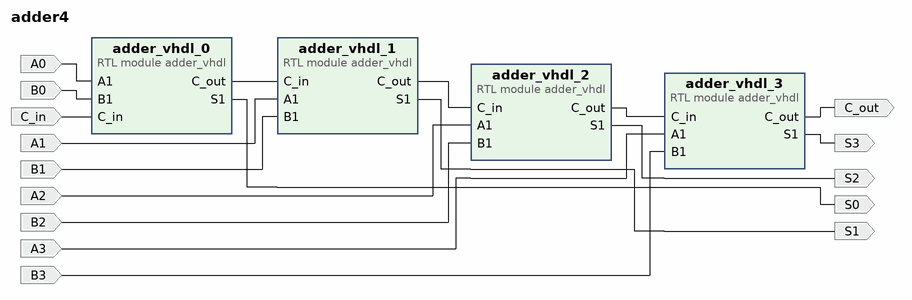
[diagram p0: block diagram of the top level]
# Vivado block design adder4, xc7a35tcpg236-1, Vivado 2018.3
create_bd_design adder4

create_bd_port -dir I A0
create_bd_port -dir I B0
create_bd_port -dir I C_in
create_bd_port -dir O S0
create_bd_port -dir I A1
create_bd_port -dir I B1
create_bd_port -dir O S1
create_bd_port -dir I A2
create_bd_port -dir I B2
create_bd_port -dir O S2
create_bd_port -dir I A3
create_bd_port -dir I B3
create_bd_port -dir O C_out
create_bd_port -dir O S3

create_bd_cell -type module -reference adder_vhdl adder_vhdl_0
create_bd_cell -type module -reference adder_vhdl adder_vhdl_1
create_bd_cell -type module -reference adder_vhdl adder_vhdl_2
create_bd_cell -type module -reference adder_vhdl adder_vhdl_3

# ---- connections ----

connect_bd_net -net A1_0_1 [get_bd_ports A0] [get_bd_pins adder_vhdl_0/A1]
connect_bd_net -net B1_0_1 [get_bd_ports B0] [get_bd_pins adder_vhdl_0/B1]
connect_bd_net -net C_in_0_1 [get_bd_ports C_in] [get_bd_pins adder_vhdl_0/C_in]
connect_bd_net [get_bd_pins adder_vhdl_0/S1] [get_bd_ports S0]
connect_bd_net -net A1_1_1 [get_bd_ports A1] [get_bd_pins adder_vhdl_1/A1]
connect_bd_net -net B1_1_1 [get_bd_ports B1] [get_bd_pins adder_vhdl_1/B1]
connect_bd_net [get_bd_pins adder_vhdl_1/S1] [get_bd_ports S1]
connect_bd_net -net A1_2_1 [get_bd_ports A2] [get_bd_pins adder_vhdl_2/A1]
connect_bd_net -net B1_2_1 [get_bd_ports B2] [get_bd_pins adder_vhdl_2/B1]
connect_bd_net [get_bd_pins adder_vhdl_2/S1] [get_bd_ports S2]
connect_bd_net -net A1_3_1 [get_bd_ports A3] [get_bd_pins adder_vhdl_3/A1]
connect_bd_net -net B1_3_1 [get_bd_ports B3] [get_bd_pins adder_vhdl_3/B1]
connect_bd_net [get_bd_pins adder_vhdl_3/C_out] [get_bd_ports C_out]
connect_bd_net [get_bd_pins adder_vhdl_3/S1] [get_bd_ports S3]
connect_bd_net [get_bd_pins adder_vhdl_0/C_out] [get_bd_pins adder_vhdl_1/C_in]
connect_bd_net [get_bd_pins adder_vhdl_1/C_out] [get_bd_pins adder_vhdl_2/C_in]
connect_bd_net [get_bd_pins adder_vhdl_2/C_out] [get_bd_pins adder_vhdl_3/C_in]

validate_bd_design
save_bd_design
